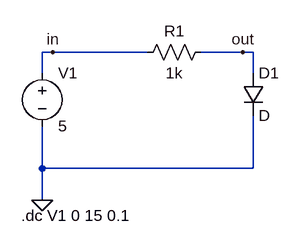
[diagram p0: schematic Draft2.asc]
Draft2.asc, the LTspice schematic file:
Version 4.1
SHEET 1 880 680
WIRE 16 64 0 64
WIRE 160 64 16 64
WIRE 304 64 240 64
WIRE 320 64 304 64
WIRE 0 96 0 64
WIRE 320 96 320 64
WIRE 0 240 0 176
WIRE 320 240 320 160
WIRE 320 240 0 240
WIRE 0 288 0 240
FLAG 0 288 0
FLAG 16 64 in
FLAG 304 64 out
SYMBOL voltage 0 80 R0
SYMATTR InstName V1
SYMATTR Value 5
SYMBOL res 256 48 R90
WINDOW 0 0 56 VBottom 2
WINDOW 3 32 56 VTop 2
SYMATTR InstName R1
SYMATTR Value 1k
SYMBOL diode 304 96 R0
SYMATTR InstName D1
TEXT -32 312 Left 2 !.dc V1 0 15 0.1

The netlist it stands for:
* Draft2.asc
V1 in 0 5
R1 out in 1k
D1 out 0 D
.model D D
.lib standard.dio
.dc V1 0 15 0.1
.backanno
.end

* Results of the author's LTspice run, read from the files saved beside the schematic
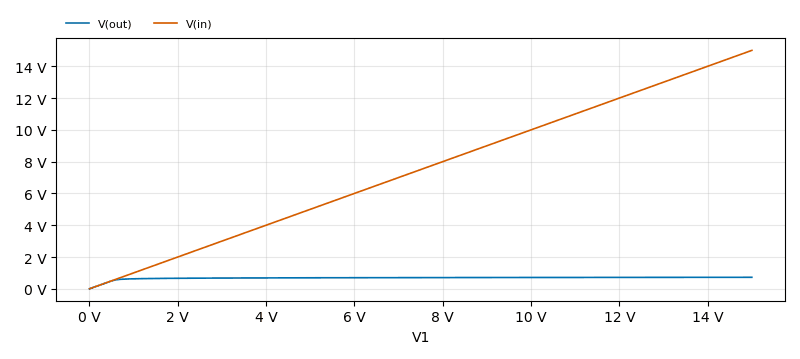
[diagram p1: DC transfer characteristic of Draft2.asc, plotted from the saved traces]
* DC transfer characteristic, 1 run:
*   V(out): 0 V at V1=0 V, 723.9 mV at V1=15 V, min 0 V, max 723.9 mV
*   V(in): 0 V at V1=0 V, 15 V at V1=15 V, min 0 V, max 15 V